# EAGLE schematic mainboard (EAGLE 7.4.0)

## Sheet 1 of 5
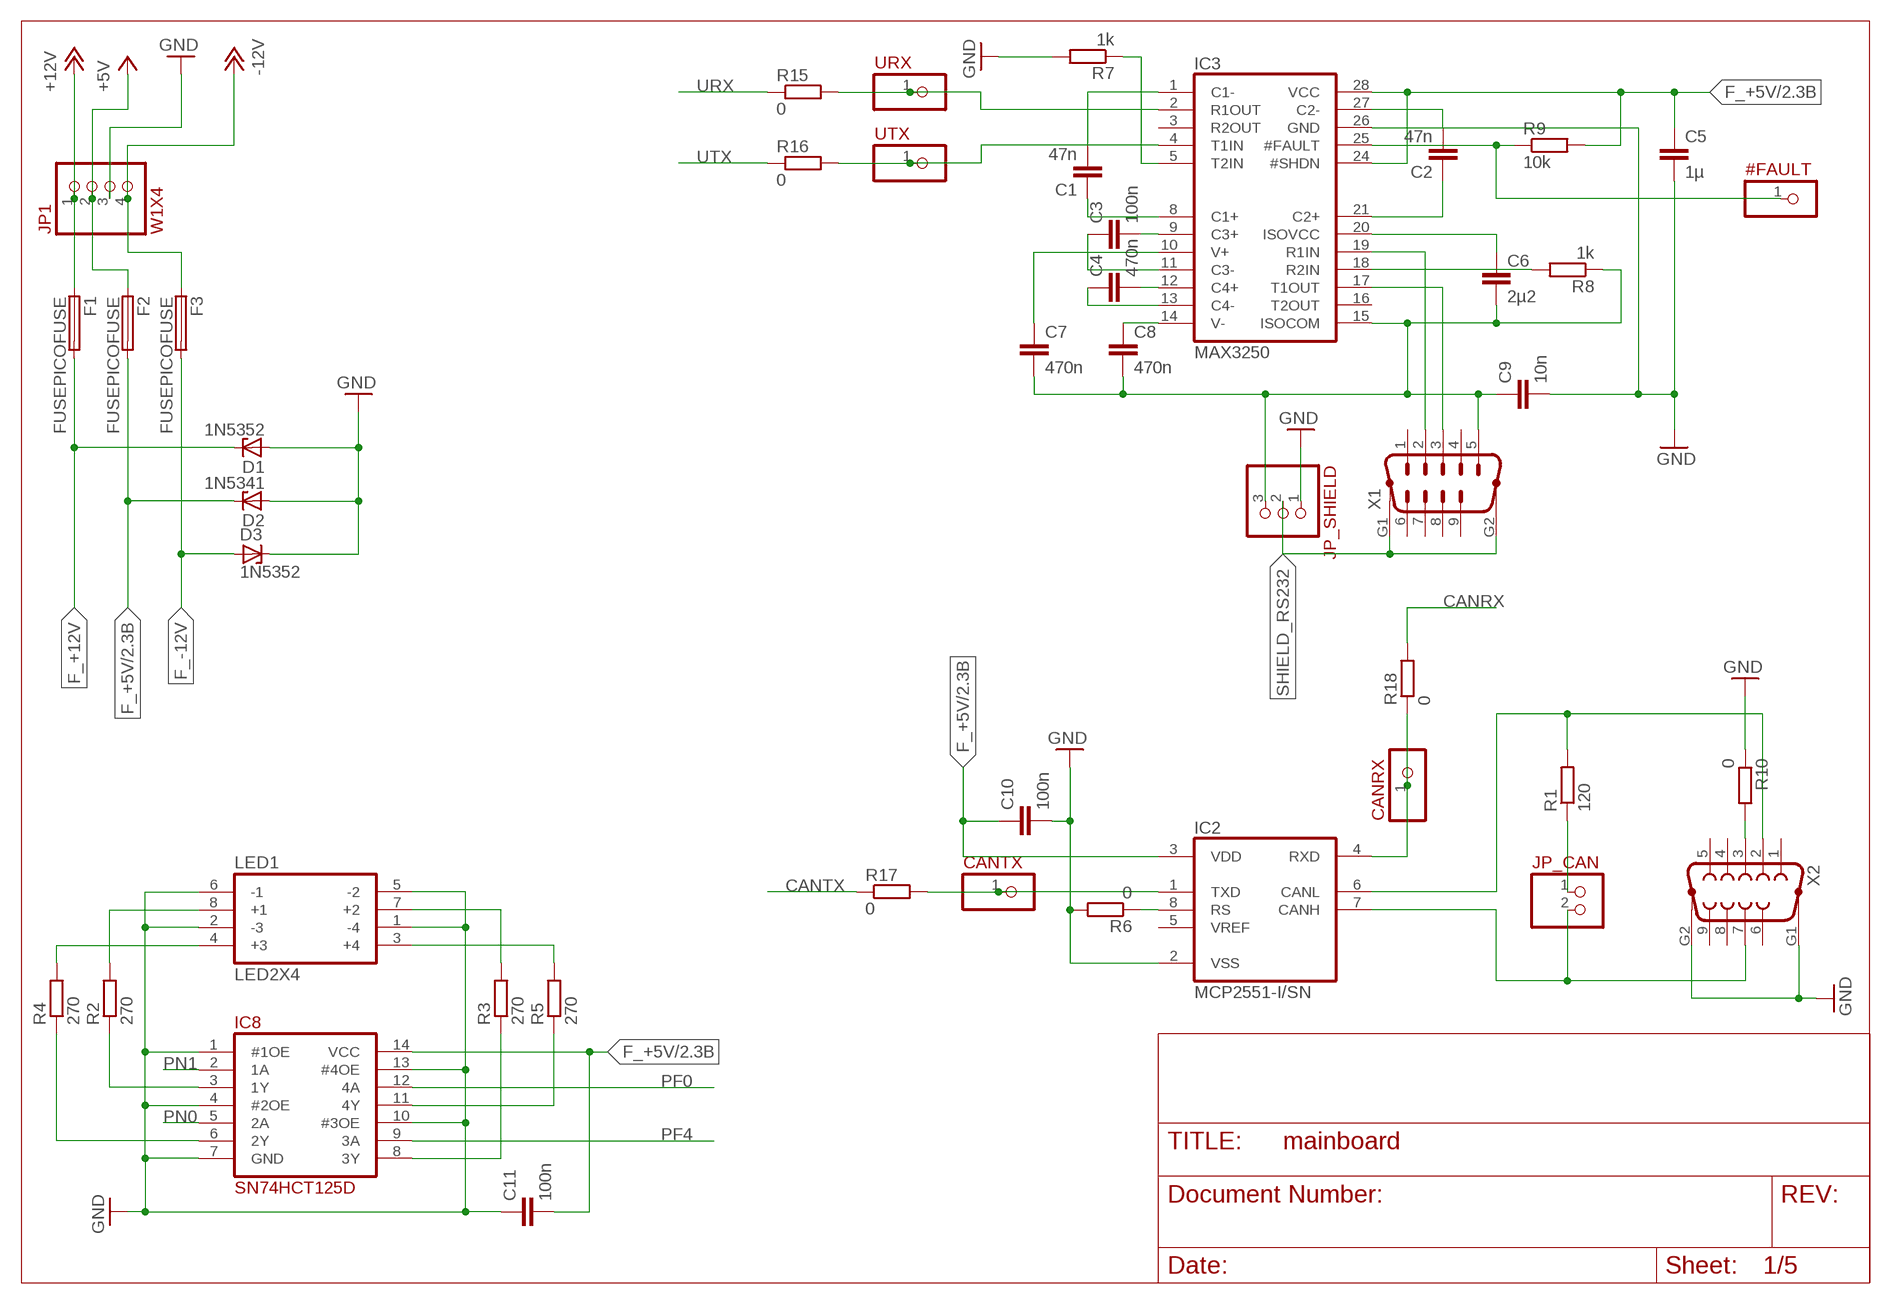
[diagram p0: schematic, sheet 1]

### Parts
#FAULT  PINH-1X1  [1X1]
C1  47n  C2220  [C2220]
C2  47n  C2220  [C2220]
C3  100n  C-EUC0805  [C0805]
C4  470n  C-EUC0805  [C0805]
C5  1µ  C-EUC0805  [C0805]
C6  2µ2  C-EUC0805  [C0805]
C7  470n  C-EUC0805  [C0805]
C8  470n  C-EUC0805  [C0805]
C9  10n  C1812  [C1812]
C10  100n  C-EUC0805  [C0805]
C11  100n  C-EUC0805  [C0805]
CANRX  PINH-1X1  [1X1]
CANTX  PINH-1X1  [1X1]
D1  1N5352  1N5333  [C1702-15]
D2  1N5341  1N5333  [C1702-15]
D3  1N5352  1N5333  [C1702-15]
F1  FUSEPICOFUSE  [PICOFUSE]
F2  FUSEPICOFUSE  [PICOFUSE]
F3  FUSEPICOFUSE  [PICOFUSE]
IC2  MCP2551-I/SN  [SO08]
IC3  MAX3250  [SSOP28_A28M-3]
IC8  SN74HCT125D  [SOIC14_D]
JP1  W1X4  [W1X4]
JP_CAN  PINH-1X2  [1X2]
JP_SHIELD  PINH-1X3  [1X3]
LED1  LED2X4  [LED2X4]
R1  120  R-EU_R0805  [R0805]
R2  270  R-EU_R0805  [R0805]
R3  270  R-EU_R0805  [R0805]
R4  270  R-EU_R0805  [R0805]
R5  270  R-EU_R0805  [R0805]
R6  0  R-EU_R0805  [R0805]
R7  1k  R-EU_R0805  [R0805]
R8  1k  R-EU_R0805  [R0805]
R9  10k  R-EU_R0805  [R0805]
R10  0  R-EU_R0805  [R0805]
R15  0  R-EU_R0805  [R0805]
R16  0  R-EU_R0805  [R0805]
R17  0  R-EU_R0805  [R0805]
R18  0  R-EU_R0805  [R0805]
URX  PINH-1X1  [1X1]
UTX  PINH-1X1  [1X1]
X1  M09HP  [M09HP]
X2  F09HP  [F09HP]

### Nets
+5V: F2.1 JP1.2
+12V: F1.1 JP1.1
-12V: F3.1 JP1.4
CANRX: R18.2 ; also sheet 2
CANTX: R17.1 ; also sheet 2
F_+5V: C5.1 C10.1 C11.2 D2.C F2.2 IC2.3(VDD) IC3.24(#SHDN) IC3.28(VCC) IC8.14(VCC) R9.2 ; also sheet 2,3,4,5
F_+12V: D1.C F1.2 ; also sheet 3,4,5
F_-12V: D3.A F3.2 ; also sheet 3,4,5
GND: C5.2 C9.2 C10.2 C11.1 D1.A D2.A D3.C IC2.2(VSS) IC3.26(GND) IC8.1(#1OE) IC8.4(#2OE) IC8.7(GND) IC8.10(#3OE) IC8.13(#4OE) JP1.3 JP_SHIELD.1 LED1.1(-4) LED1.2(-3) LED1.5(-2) LED1.6(-1) R6.2 R7.2 R10.1 X2.G1 X2.G2 ; also sheet 2,3,4,5
ISOCOM: C6.2 C7.2 C8.2 C9.1 IC3.15(ISOCOM) JP_SHIELD.3 R8.1 X1.5
N$1: JP_CAN.1 R1.1
N$2: IC3.17(T1OUT) X1.3
N$3: C4.2 IC3.12(C4+)
N$4: C4.1 IC3.13(C4-)
N$5: IC3.19(R1IN) X1.2
N$6: C3.2 IC3.9(C3+)
N$7: C3.1 IC3.11(C3-)
N$8: C2.1 IC3.21(C2+)
N$9: C2.2 IC3.27(C2-)
N$10: C1.2 IC3.1(C1-)
N$11: C1.1 IC3.8(C1+)
N$12: C6.1 IC3.20(ISOVCC)
N$13: IC3.2(R1OUT) R15.2 URX.1
N$14: IC3.4(T1IN) R16.2 UTX.1
N$15: CANTX.1 IC2.1(TXD) R17.2
N$16: CANRX.1 IC2.4(RXD) R18.1
N$17: IC2.8(RS) R6.1
N$18: LED1.7(+2) R3.2
N$19: IC8.3(1Y) R2.1
N$20: IC8.6(2Y) R4.1
N$21: IC8.8(3Y) R3.1
N$22: IC8.11(4Y) R5.1
N$23: LED1.3(+4) R5.2
N$24: LED1.8(+1) R2.2
N$25: LED1.4(+3) R4.2
N$26: IC3.18(R2IN) R8.2
N$27: IC3.5(T2IN) R7.1
N$28: #FAULT.1 IC3.25(#FAULT) R9.1
N$30: R10.2 X2.3
N$96: IC2.7(CANH) JP_CAN.2 X2.7
N$97: IC2.6(CANL) R1.2 X2.2
PF0: IC8.12(4A) ; also sheet 3,4,5
PF4: IC8.9(3A) ; also sheet 3,4,5
PN0: IC8.5(2A) ; also sheet 3,4,5
PN1: IC8.2(1A) ; also sheet 3,4,5
SHIELD_RS232: JP_SHIELD.2 X1.G1 X1.G2
URX: R15.1 ; also sheet 2
UTX: R16.1 ; also sheet 2
V+: C7.1 IC3.10(V+)
V-: C8.1 IC3.14(V-)
Unconnected: IC2.5(VREF) IC3.3(R2OUT) IC3.16(T2OUT) X1.1 X1.4 X1.6 X1.7 X1.8 X1.9 X2.1 X2.4 X2.5 X2.6 X2.8 X2.9

## Sheet 2 of 5
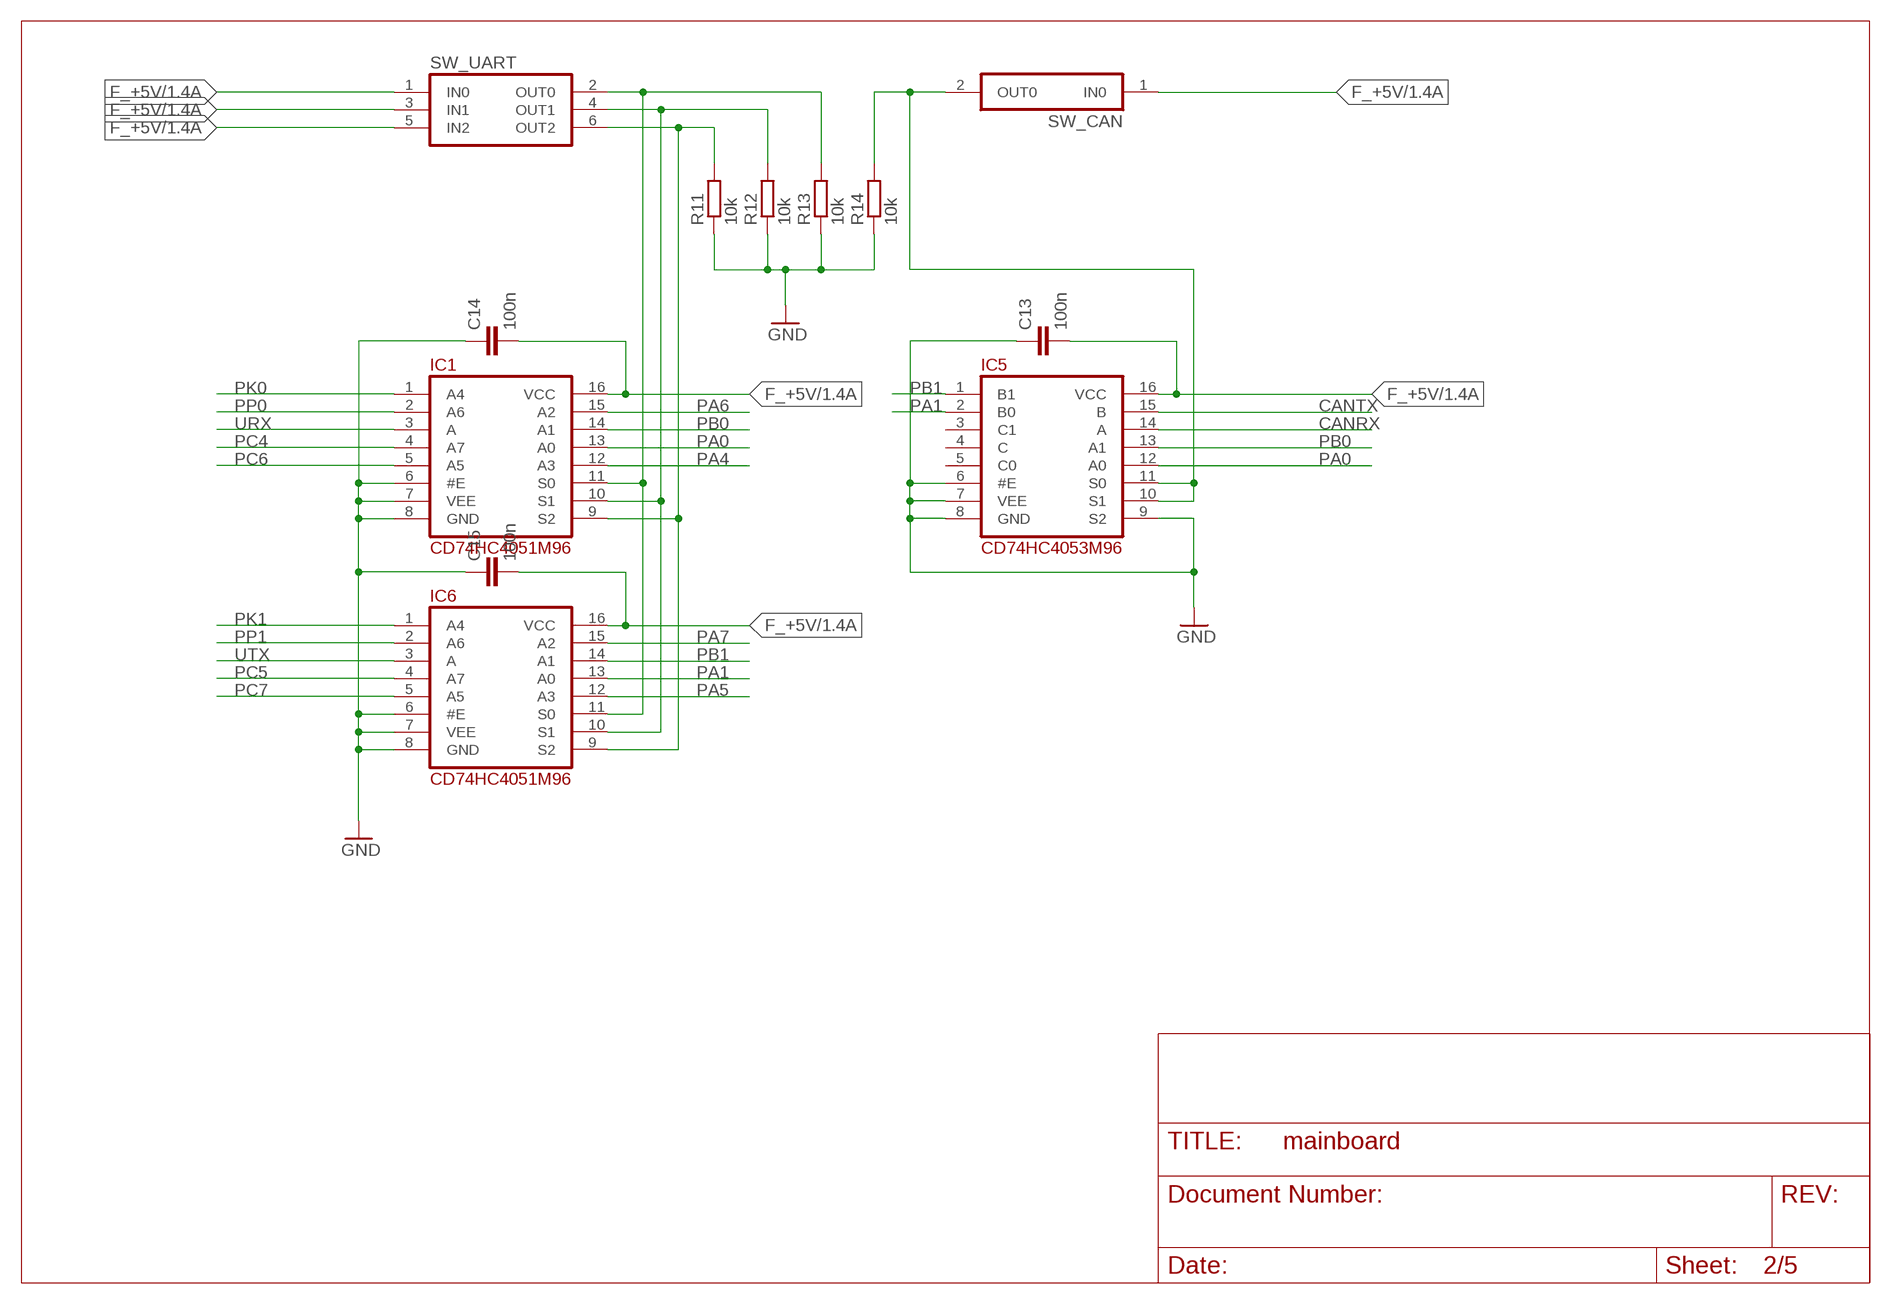
[diagram p1: schematic, sheet 2]

### Parts
C13  100n  C-EUC0805  [C0805]
C14  100n  C-EUC0805  [C0805]
C15  100n  C-EUC0805  [C0805]
IC1  CD74HC4051M96  [SOIC16_D]
IC5  CD74HC4053M96  [SOIC16_D]
IC6  CD74HC4051M96  [SOIC16_D]
R11  10k  R-EU_R0805  [R0805]
R12  10k  R-EU_R0805  [R0805]
R13  10k  R-EU_R0805  [R0805]
R14  10k  R-EU_R0805  [R0805]
SW_CAN  NT01  [NT01]
SW_UART  NT03  [NT03]

### Nets
CANRX: IC5.14(A) ; also sheet 1
CANTX: IC5.15(B) ; also sheet 1
F_+5V: C13.2 C14.2 C15.2 IC1.16(VCC) IC5.16(VCC) IC6.16(VCC) SW_CAN.1(IN0) SW_UART.1(IN0) SW_UART.3(IN1) SW_UART.5(IN2) ; also sheet 1,3,4,5
GND: C13.1 C14.1 C15.1 IC1.6(#E) IC1.7(VEE) IC1.8(GND) IC5.6(#E) IC5.7(VEE) IC5.8(GND) IC5.9(S2) IC6.6(#E) IC6.7(VEE) IC6.8(GND) R11.1 R12.1 R13.1 R14.1 ; also sheet 1,3,4,5
N$32: IC1.9(S2) IC6.9(S2) R11.2 SW_UART.6(OUT2)
N$33: IC1.10(S1) IC6.10(S1) R12.2 SW_UART.4(OUT1)
N$34: IC1.11(S0) IC6.11(S0) R13.2 SW_UART.2(OUT0)
N$35: IC5.10(S1) IC5.11(S0) R14.2 SW_CAN.2(OUT0)
PA0: IC1.13(A0) IC5.12(A0) ; also sheet 3,4,5
PA1: IC5.2(B0) IC6.13(A0) ; also sheet 3,4,5
PA4: IC1.12(A3) ; also sheet 3,4,5
PA5: IC6.12(A3) ; also sheet 3,4,5
PA6: IC1.15(A2) ; also sheet 3,4,5
PA7: IC6.15(A2) ; also sheet 3,4,5
PB0: IC1.14(A1) IC5.13(A1) ; also sheet 3,4,5
PB1: IC5.1(B1) IC6.14(A1) ; also sheet 3,4,5
PC4: IC1.4(A7) ; also sheet 3,4,5
PC5: IC6.4(A7) ; also sheet 3,4,5
PC6: IC1.5(A5) ; also sheet 3,4,5
PC7: IC6.5(A5) ; also sheet 3,4,5
PK0: IC1.1(A4) ; also sheet 3,4,5
PK1: IC6.1(A4) ; also sheet 3,4,5
PP0: IC1.2(A6) ; also sheet 3,4,5
PP1: IC6.2(A6) ; also sheet 3,4,5
URX: IC1.3(A) ; also sheet 1
UTX: IC6.3(A) ; also sheet 1
Unconnected: IC5.3(C1) IC5.4(C) IC5.5(C0)

## Sheet 3 of 5
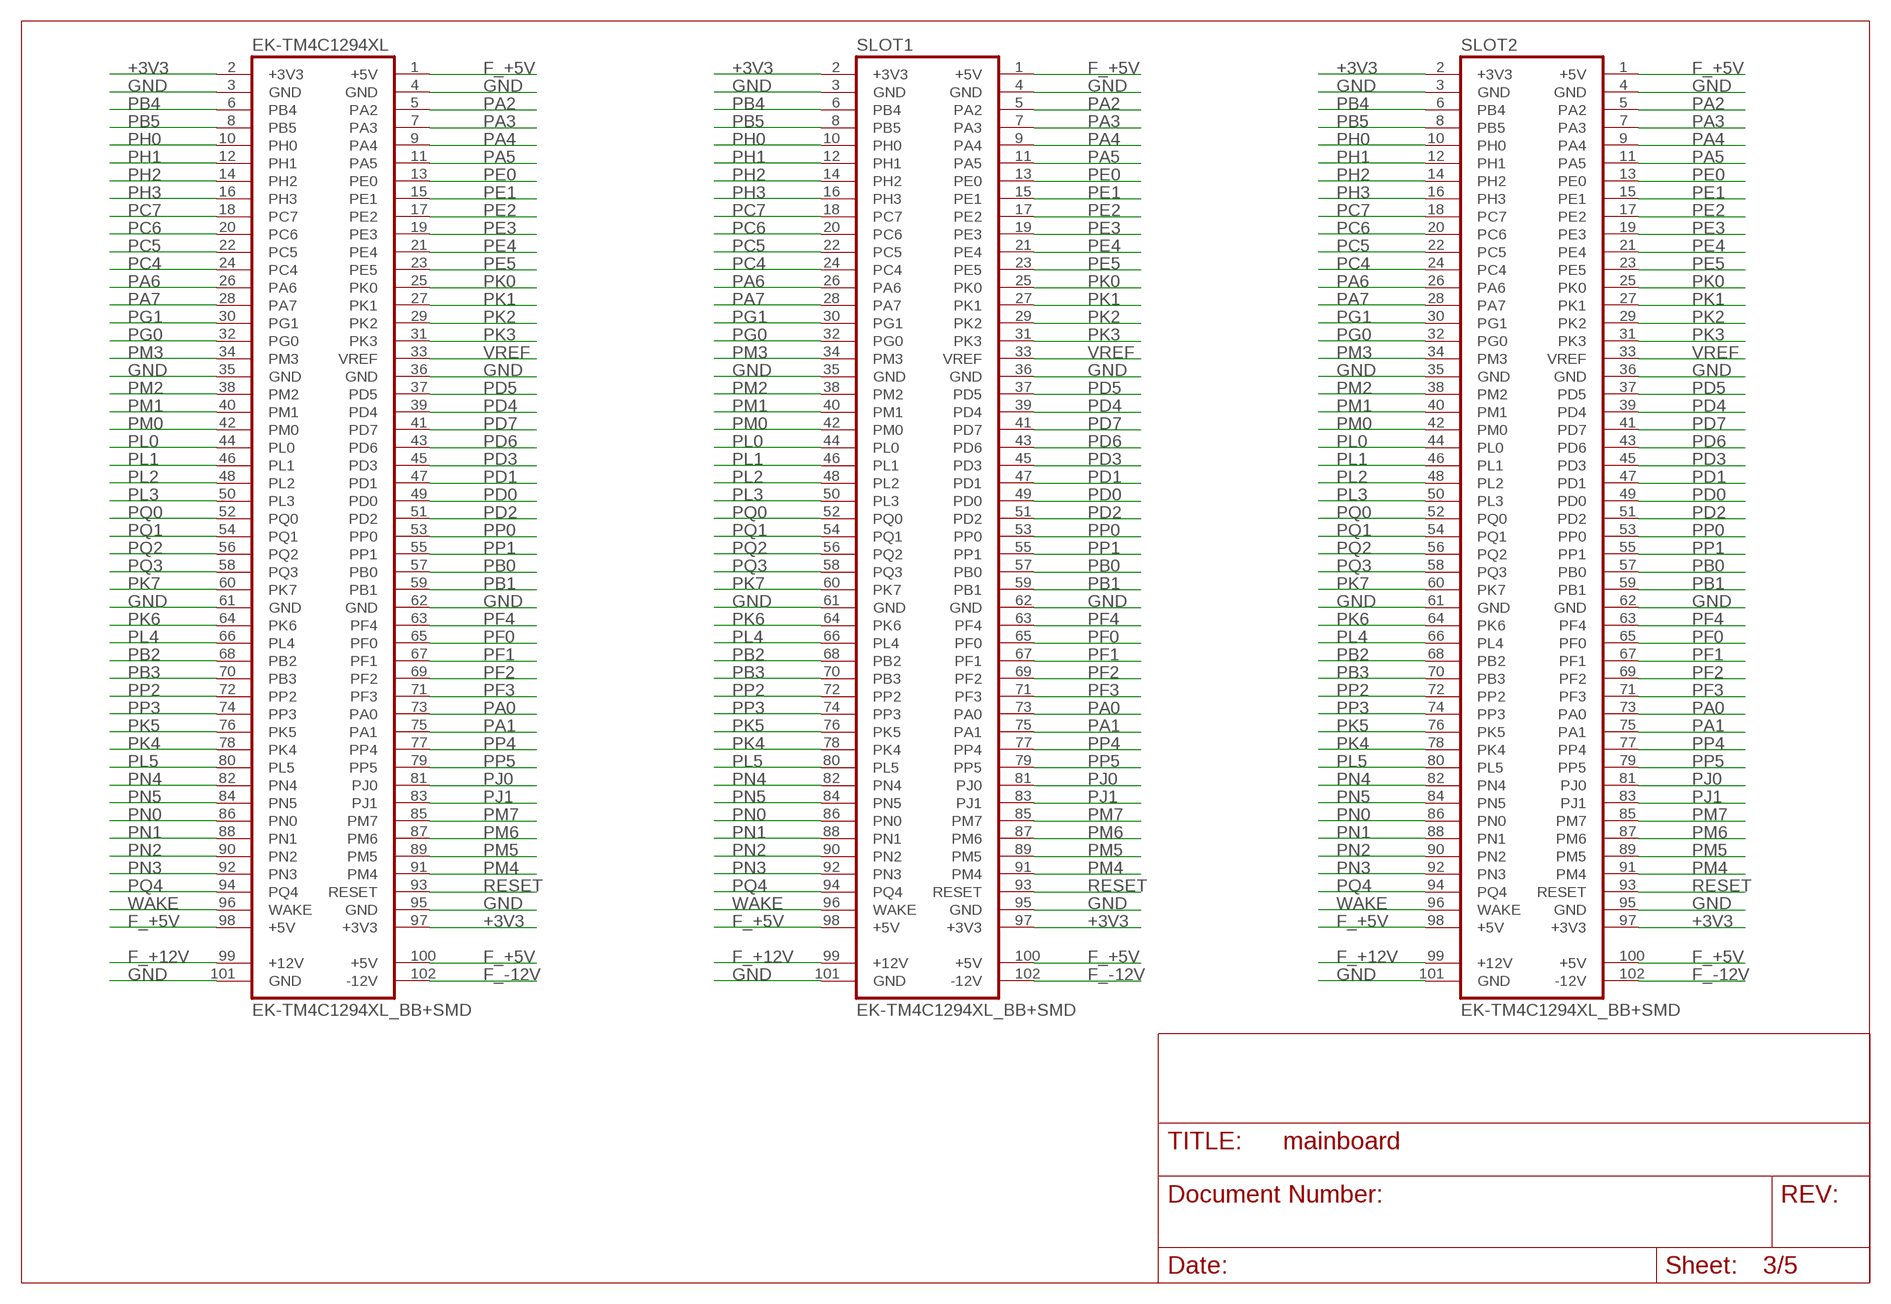
[diagram p2: schematic, sheet 3]

### Parts
EK-TM4C1294XL  EK-TM4C1294XL_BB+SMD  [EK-TM4C1294XL_BB+SMD]
SLOT1  EK-TM4C1294XL_BB+SMD  [EK-TM4C1294XL_BB+SMD]
SLOT2  EK-TM4C1294XL_BB+SMD  [EK-TM4C1294XL_BB+SMD]

### Nets
+3V3: EK-TM4C1294XL.2(+3V3) EK-TM4C1294XL.97(+3V3) SLOT1.2(+3V3) SLOT1.97(+3V3) SLOT2.2(+3V3) SLOT2.97(+3V3) ; also sheet 4,5
F_+5V: EK-TM4C1294XL.1(+5V) EK-TM4C1294XL.98(+5V) EK-TM4C1294XL.100(+5V) SLOT1.1(+5V) SLOT1.98(+5V) SLOT1.100(+5V) SLOT2.1(+5V) SLOT2.98(+5V) SLOT2.100(+5V) ; also sheet 1,2,4,5
F_+12V: EK-TM4C1294XL.99(+12V) SLOT1.99(+12V) SLOT2.99(+12V) ; also sheet 1,4,5
F_-12V: EK-TM4C1294XL.102(-12V) SLOT1.102(-12V) SLOT2.102(-12V) ; also sheet 1,4,5
GND: EK-TM4C1294XL.3(GND) EK-TM4C1294XL.4(GND) EK-TM4C1294XL.35(GND) EK-TM4C1294XL.36(GND) EK-TM4C1294XL.61(GND) EK-TM4C1294XL.62(GND) EK-TM4C1294XL.95(GND) EK-TM4C1294XL.101(GND) SLOT1.3(GND) SLOT1.4(GND) SLOT1.35(GND) SLOT1.36(GND) SLOT1.61(GND) SLOT1.62(GND) SLOT1.95(GND) SLOT1.101(GND) SLOT2.3(GND) SLOT2.4(GND) SLOT2.35(GND) SLOT2.36(GND) SLOT2.61(GND) SLOT2.62(GND) SLOT2.95(GND) SLOT2.101(GND) ; also sheet 1,2,4,5
PA0: EK-TM4C1294XL.73(PA0) SLOT1.73(PA0) SLOT2.73(PA0) ; also sheet 2,4,5
PA1: EK-TM4C1294XL.75(PA1) SLOT1.75(PA1) SLOT2.75(PA1) ; also sheet 2,4,5
PA2: EK-TM4C1294XL.5(PA2) SLOT1.5(PA2) SLOT2.5(PA2) ; also sheet 4,5
PA3: EK-TM4C1294XL.7(PA3) SLOT1.7(PA3) SLOT2.7(PA3) ; also sheet 4,5
PA4: EK-TM4C1294XL.9(PA4) SLOT1.9(PA4) SLOT2.9(PA4) ; also sheet 2,4,5
PA5: EK-TM4C1294XL.11(PA5) SLOT1.11(PA5) SLOT2.11(PA5) ; also sheet 2,4,5
PA6: EK-TM4C1294XL.26(PA6) SLOT1.26(PA6) SLOT2.26(PA6) ; also sheet 2,4,5
PA7: EK-TM4C1294XL.28(PA7) SLOT1.28(PA7) SLOT2.28(PA7) ; also sheet 2,4,5
PB0: EK-TM4C1294XL.57(PB0) SLOT1.57(PB0) SLOT2.57(PB0) ; also sheet 2,4,5
PB1: EK-TM4C1294XL.59(PB1) SLOT1.59(PB1) SLOT2.59(PB1) ; also sheet 2,4,5
PB2: EK-TM4C1294XL.68(PB2) SLOT1.68(PB2) SLOT2.68(PB2) ; also sheet 4,5
PB3: EK-TM4C1294XL.70(PB3) SLOT1.70(PB3) SLOT2.70(PB3) ; also sheet 4,5
PB4: EK-TM4C1294XL.6(PB4) SLOT1.6(PB4) SLOT2.6(PB4) ; also sheet 4,5
PB5: EK-TM4C1294XL.8(PB5) SLOT1.8(PB5) SLOT2.8(PB5) ; also sheet 4,5
PC4: EK-TM4C1294XL.24(PC4) SLOT1.24(PC4) SLOT2.24(PC4) ; also sheet 2,4,5
PC5: EK-TM4C1294XL.22(PC5) SLOT1.22(PC5) SLOT2.22(PC5) ; also sheet 2,4,5
PC6: EK-TM4C1294XL.20(PC6) SLOT1.20(PC6) SLOT2.20(PC6) ; also sheet 2,4,5
PC7: EK-TM4C1294XL.18(PC7) SLOT1.18(PC7) SLOT2.18(PC7) ; also sheet 2,4,5
PD0: EK-TM4C1294XL.49(PD0) SLOT1.49(PD0) SLOT2.49(PD0) ; also sheet 4,5
PD1: EK-TM4C1294XL.47(PD1) SLOT1.47(PD1) SLOT2.47(PD1) ; also sheet 4,5
PD2: EK-TM4C1294XL.51(PD2) SLOT1.51(PD2) SLOT2.51(PD2) ; also sheet 4,5
PD3: EK-TM4C1294XL.45(PD3) SLOT1.45(PD3) SLOT2.45(PD3) ; also sheet 4,5
PD4: EK-TM4C1294XL.39(PD4) SLOT1.39(PD4) SLOT2.39(PD4) ; also sheet 4,5
PD5: EK-TM4C1294XL.37(PD5) SLOT1.37(PD5) SLOT2.37(PD5) ; also sheet 4,5
PD6: EK-TM4C1294XL.43(PD6) SLOT1.43(PD6) SLOT2.43(PD6) ; also sheet 4,5
PD7: EK-TM4C1294XL.41(PD7) SLOT1.41(PD7) SLOT2.41(PD7) ; also sheet 4,5
PE0: EK-TM4C1294XL.13(PE0) SLOT1.13(PE0) SLOT2.13(PE0) ; also sheet 4,5
PE1: EK-TM4C1294XL.15(PE1) SLOT1.15(PE1) SLOT2.15(PE1) ; also sheet 4,5
PE2: EK-TM4C1294XL.17(PE2) SLOT1.17(PE2) SLOT2.17(PE2) ; also sheet 4,5
PE3: EK-TM4C1294XL.19(PE3) SLOT1.19(PE3) SLOT2.19(PE3) ; also sheet 4,5
PE4: EK-TM4C1294XL.21(PE4) SLOT1.21(PE4) SLOT2.21(PE4) ; also sheet 4,5
PE5: EK-TM4C1294XL.23(PE5) SLOT1.23(PE5) SLOT2.23(PE5) ; also sheet 4,5
PF0: EK-TM4C1294XL.65(PF0) SLOT1.65(PF0) SLOT2.65(PF0) ; also sheet 1,4,5
PF1: EK-TM4C1294XL.67(PF1) SLOT1.67(PF1) SLOT2.67(PF1) ; also sheet 4,5
PF2: EK-TM4C1294XL.69(PF2) SLOT1.69(PF2) SLOT2.69(PF2) ; also sheet 4,5
PF3: EK-TM4C1294XL.71(PF3) SLOT1.71(PF3) SLOT2.71(PF3) ; also sheet 4,5
PF4: EK-TM4C1294XL.63(PF4) SLOT1.63(PF4) SLOT2.63(PF4) ; also sheet 1,4,5
PG0: EK-TM4C1294XL.32(PG0) SLOT1.32(PG0) SLOT2.32(PG0) ; also sheet 4,5
PG1: EK-TM4C1294XL.30(PG1) SLOT1.30(PG1) SLOT2.30(PG1) ; also sheet 4,5
PH0: EK-TM4C1294XL.10(PH0) SLOT1.10(PH0) SLOT2.10(PH0) ; also sheet 4,5
PH1: EK-TM4C1294XL.12(PH1) SLOT1.12(PH1) SLOT2.12(PH1) ; also sheet 4,5
PH2: EK-TM4C1294XL.14(PH2) SLOT1.14(PH2) SLOT2.14(PH2) ; also sheet 4,5
PH3: EK-TM4C1294XL.16(PH3) SLOT1.16(PH3) SLOT2.16(PH3) ; also sheet 4,5
PJ0: EK-TM4C1294XL.81(PJ0) SLOT1.81(PJ0) SLOT2.81(PJ0) ; also sheet 4,5
PJ1: EK-TM4C1294XL.83(PJ1) SLOT1.83(PJ1) SLOT2.83(PJ1) ; also sheet 4,5
PK0: EK-TM4C1294XL.25(PK0) SLOT1.25(PK0) SLOT2.25(PK0) ; also sheet 2,4,5
PK1: EK-TM4C1294XL.27(PK1) SLOT1.27(PK1) SLOT2.27(PK1) ; also sheet 2,4,5
PK2: EK-TM4C1294XL.29(PK2) SLOT1.29(PK2) SLOT2.29(PK2) ; also sheet 4,5
PK3: EK-TM4C1294XL.31(PK3) SLOT1.31(PK3) SLOT2.31(PK3) ; also sheet 4,5
PK4: EK-TM4C1294XL.78(PK4) SLOT1.78(PK4) SLOT2.78(PK4) ; also sheet 4,5
PK5: EK-TM4C1294XL.76(PK5) SLOT1.76(PK5) SLOT2.76(PK5) ; also sheet 4,5
PK6: EK-TM4C1294XL.64(PK6) SLOT1.64(PK6) SLOT2.64(PK6) ; also sheet 4,5
PK7: EK-TM4C1294XL.60(PK7) SLOT1.60(PK7) SLOT2.60(PK7) ; also sheet 4,5
PL0: EK-TM4C1294XL.44(PL0) SLOT1.44(PL0) SLOT2.44(PL0) ; also sheet 4,5
PL1: EK-TM4C1294XL.46(PL1) SLOT1.46(PL1) SLOT2.46(PL1) ; also sheet 4,5
PL2: EK-TM4C1294XL.48(PL2) SLOT1.48(PL2) SLOT2.48(PL2) ; also sheet 4,5
PL3: EK-TM4C1294XL.50(PL3) SLOT1.50(PL3) SLOT2.50(PL3) ; also sheet 4,5
PL4: EK-TM4C1294XL.66(PL4) SLOT1.66(PL4) SLOT2.66(PL4) ; also sheet 4,5
PL5: EK-TM4C1294XL.80(PL5) SLOT1.80(PL5) SLOT2.80(PL5) ; also sheet 4,5
PM0: EK-TM4C1294XL.42(PM0) SLOT1.42(PM0) SLOT2.42(PM0) ; also sheet 4,5
PM1: EK-TM4C1294XL.40(PM1) SLOT1.40(PM1) SLOT2.40(PM1) ; also sheet 4,5
PM2: EK-TM4C1294XL.38(PM2) SLOT1.38(PM2) SLOT2.38(PM2) ; also sheet 4,5
PM3: EK-TM4C1294XL.34(PM3) SLOT1.34(PM3) SLOT2.34(PM3) ; also sheet 4,5
PM4: EK-TM4C1294XL.91(PM4) SLOT1.91(PM4) SLOT2.91(PM4) ; also sheet 4,5
PM5: EK-TM4C1294XL.89(PM5) SLOT1.89(PM5) SLOT2.89(PM5) ; also sheet 4,5
PM6: EK-TM4C1294XL.87(PM6) SLOT1.87(PM6) SLOT2.87(PM6) ; also sheet 4,5
PM7: EK-TM4C1294XL.85(PM7) SLOT1.85(PM7) SLOT2.85(PM7) ; also sheet 4,5
PN0: EK-TM4C1294XL.86(PN0) SLOT1.86(PN0) SLOT2.86(PN0) ; also sheet 1,4,5
PN1: EK-TM4C1294XL.88(PN1) SLOT1.88(PN1) SLOT2.88(PN1) ; also sheet 1,4,5
PN2: EK-TM4C1294XL.90(PN2) SLOT1.90(PN2) SLOT2.90(PN2) ; also sheet 4,5
PN3: EK-TM4C1294XL.92(PN3) SLOT1.92(PN3) SLOT2.92(PN3) ; also sheet 4,5
PN4: EK-TM4C1294XL.82(PN4) SLOT1.82(PN4) SLOT2.82(PN4) ; also sheet 4,5
PN5: EK-TM4C1294XL.84(PN5) SLOT1.84(PN5) SLOT2.84(PN5) ; also sheet 4,5
PP0: EK-TM4C1294XL.53(PP0) SLOT1.53(PP0) SLOT2.53(PP0) ; also sheet 2,4,5
PP1: EK-TM4C1294XL.55(PP1) SLOT1.55(PP1) SLOT2.55(PP1) ; also sheet 2,4,5
PP2: EK-TM4C1294XL.72(PP2) SLOT1.72(PP2) SLOT2.72(PP2) ; also sheet 4,5
PP3: EK-TM4C1294XL.74(PP3) SLOT1.74(PP3) SLOT2.74(PP3) ; also sheet 4,5
PP4: EK-TM4C1294XL.77(PP4) SLOT1.77(PP4) SLOT2.77(PP4) ; also sheet 4,5
PP5: EK-TM4C1294XL.79(PP5) SLOT1.79(PP5) SLOT2.79(PP5) ; also sheet 4,5
PQ0: EK-TM4C1294XL.52(PQ0) SLOT1.52(PQ0) SLOT2.52(PQ0) ; also sheet 4,5
PQ1: EK-TM4C1294XL.54(PQ1) SLOT1.54(PQ1) SLOT2.54(PQ1) ; also sheet 4,5
PQ2: EK-TM4C1294XL.56(PQ2) SLOT1.56(PQ2) SLOT2.56(PQ2) ; also sheet 4,5
PQ3: EK-TM4C1294XL.58(PQ3) SLOT1.58(PQ3) SLOT2.58(PQ3) ; also sheet 4,5
PQ4: EK-TM4C1294XL.94(PQ4) SLOT1.94(PQ4) SLOT2.94(PQ4) ; also sheet 4,5
RESET: EK-TM4C1294XL.93(RESET) SLOT1.93(RESET) SLOT2.93(RESET) ; also sheet 4,5
VREF: EK-TM4C1294XL.33(VREF) SLOT1.33(VREF) SLOT2.33(VREF) ; also sheet 4,5
WAKE: EK-TM4C1294XL.96(WAKE) SLOT1.96(WAKE) SLOT2.96(WAKE) ; also sheet 4,5

## Sheet 4 of 5
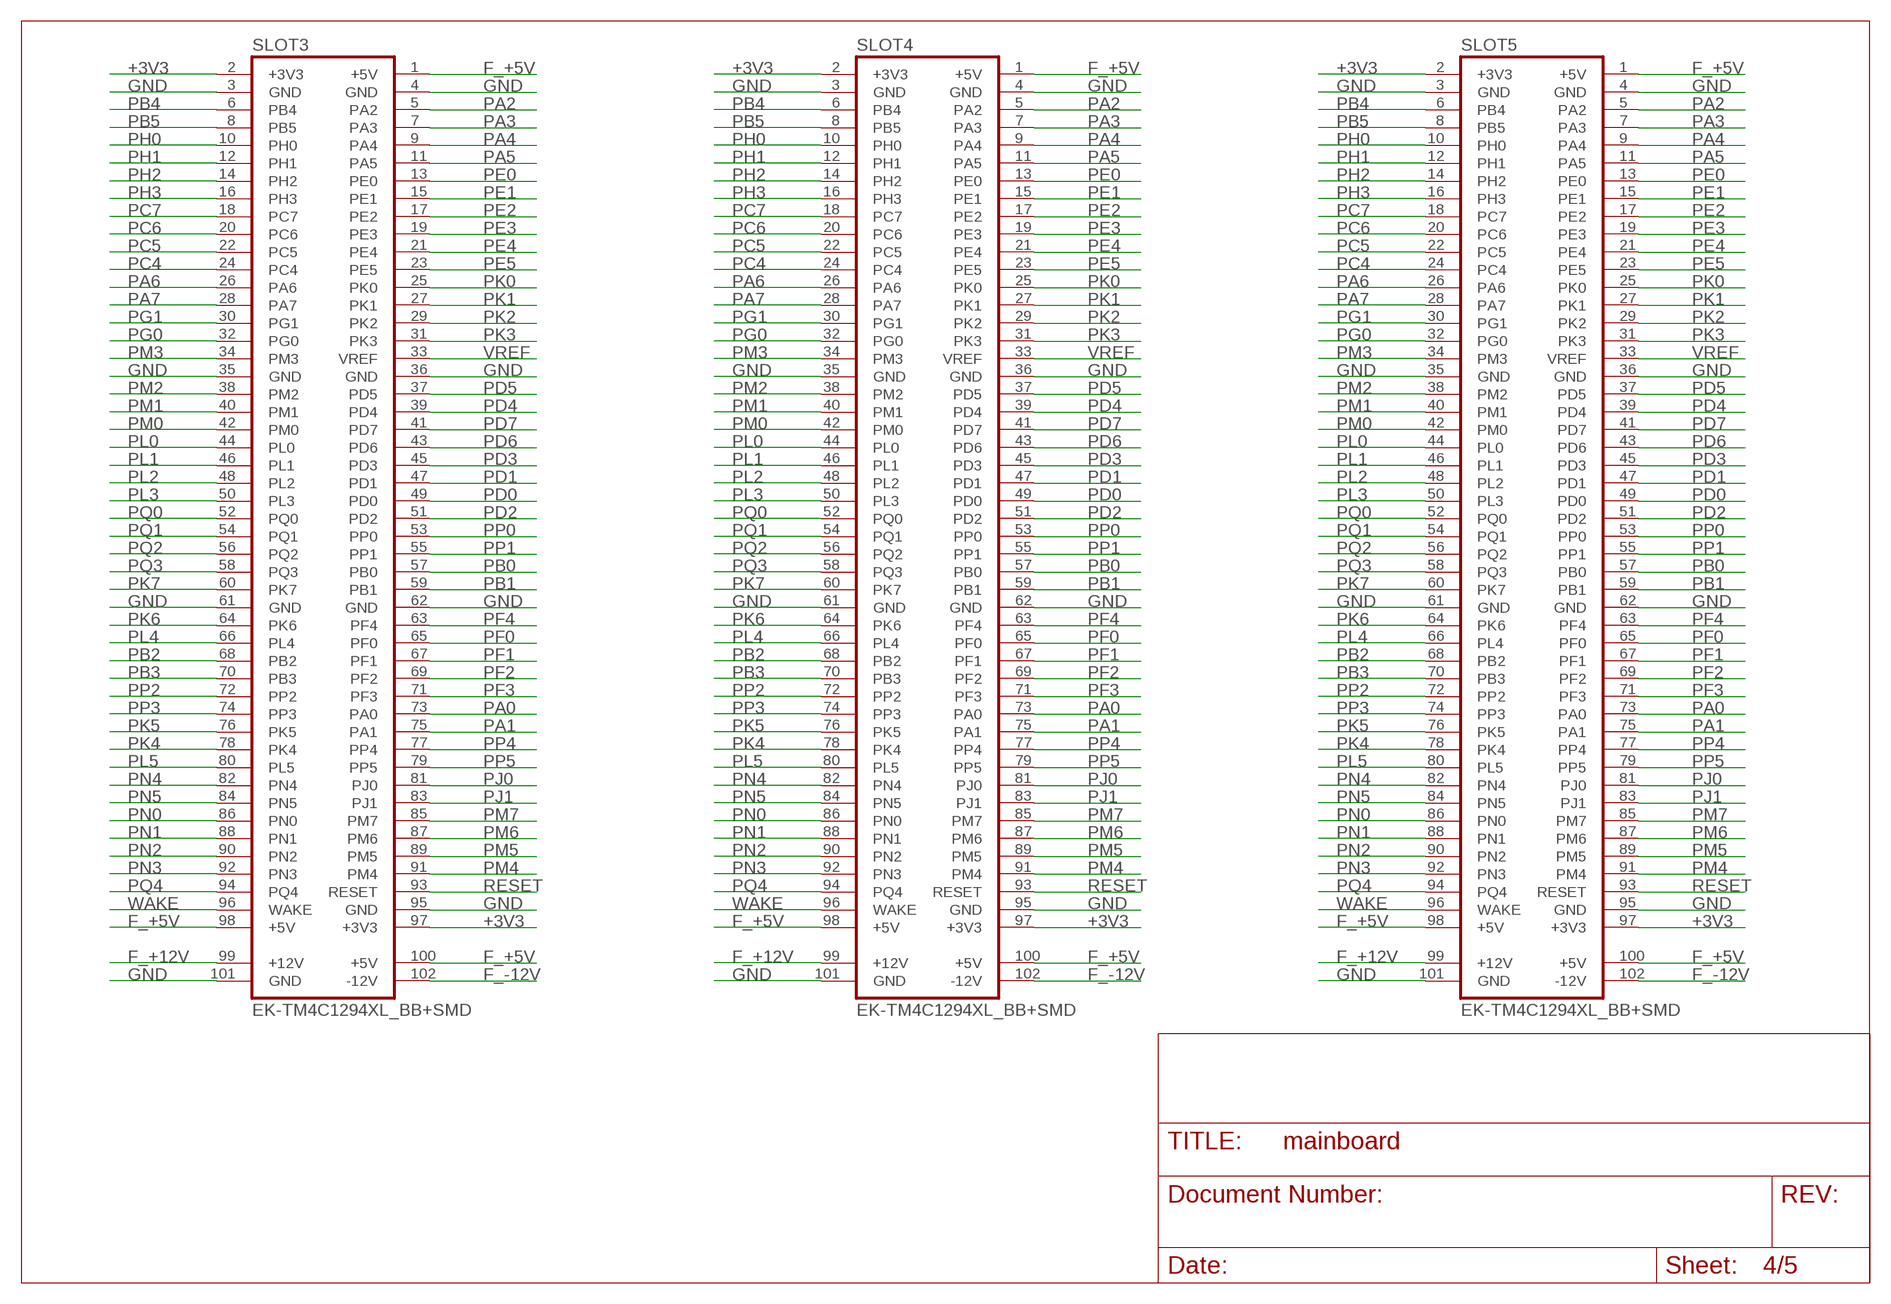
[diagram p3: schematic, sheet 4]

### Parts
SLOT3  EK-TM4C1294XL_BB+SMD  [EK-TM4C1294XL_BB+SMD]
SLOT4  EK-TM4C1294XL_BB+SMD  [EK-TM4C1294XL_BB+SMD]
SLOT5  EK-TM4C1294XL_BB+SMD  [EK-TM4C1294XL_BB+SMD]

### Nets
+3V3: SLOT3.2(+3V3) SLOT3.97(+3V3) SLOT4.2(+3V3) SLOT4.97(+3V3) SLOT5.2(+3V3) SLOT5.97(+3V3) ; also sheet 3,5
F_+5V: SLOT3.1(+5V) SLOT3.98(+5V) SLOT3.100(+5V) SLOT4.1(+5V) SLOT4.98(+5V) SLOT4.100(+5V) SLOT5.1(+5V) SLOT5.98(+5V) SLOT5.100(+5V) ; also sheet 1,2,3,5
F_+12V: SLOT3.99(+12V) SLOT4.99(+12V) SLOT5.99(+12V) ; also sheet 1,3,5
F_-12V: SLOT3.102(-12V) SLOT4.102(-12V) SLOT5.102(-12V) ; also sheet 1,3,5
GND: SLOT3.3(GND) SLOT3.4(GND) SLOT3.35(GND) SLOT3.36(GND) SLOT3.61(GND) SLOT3.62(GND) SLOT3.95(GND) SLOT3.101(GND) SLOT4.3(GND) SLOT4.4(GND) SLOT4.35(GND) SLOT4.36(GND) SLOT4.61(GND) SLOT4.62(GND) SLOT4.95(GND) SLOT4.101(GND) SLOT5.3(GND) SLOT5.4(GND) SLOT5.35(GND) SLOT5.36(GND) SLOT5.61(GND) SLOT5.62(GND) SLOT5.95(GND) SLOT5.101(GND) ; also sheet 1,2,3,5
PA0: SLOT3.73(PA0) SLOT4.73(PA0) SLOT5.73(PA0) ; also sheet 2,3,5
PA1: SLOT3.75(PA1) SLOT4.75(PA1) SLOT5.75(PA1) ; also sheet 2,3,5
PA2: SLOT3.5(PA2) SLOT4.5(PA2) SLOT5.5(PA2) ; also sheet 3,5
PA3: SLOT3.7(PA3) SLOT4.7(PA3) SLOT5.7(PA3) ; also sheet 3,5
PA4: SLOT3.9(PA4) SLOT4.9(PA4) SLOT5.9(PA4) ; also sheet 2,3,5
PA5: SLOT3.11(PA5) SLOT4.11(PA5) SLOT5.11(PA5) ; also sheet 2,3,5
PA6: SLOT3.26(PA6) SLOT4.26(PA6) SLOT5.26(PA6) ; also sheet 2,3,5
PA7: SLOT3.28(PA7) SLOT4.28(PA7) SLOT5.28(PA7) ; also sheet 2,3,5
PB0: SLOT3.57(PB0) SLOT4.57(PB0) SLOT5.57(PB0) ; also sheet 2,3,5
PB1: SLOT3.59(PB1) SLOT4.59(PB1) SLOT5.59(PB1) ; also sheet 2,3,5
PB2: SLOT3.68(PB2) SLOT4.68(PB2) SLOT5.68(PB2) ; also sheet 3,5
PB3: SLOT3.70(PB3) SLOT4.70(PB3) SLOT5.70(PB3) ; also sheet 3,5
PB4: SLOT3.6(PB4) SLOT4.6(PB4) SLOT5.6(PB4) ; also sheet 3,5
PB5: SLOT3.8(PB5) SLOT4.8(PB5) SLOT5.8(PB5) ; also sheet 3,5
PC4: SLOT3.24(PC4) SLOT4.24(PC4) SLOT5.24(PC4) ; also sheet 2,3,5
PC5: SLOT3.22(PC5) SLOT4.22(PC5) SLOT5.22(PC5) ; also sheet 2,3,5
PC6: SLOT3.20(PC6) SLOT4.20(PC6) SLOT5.20(PC6) ; also sheet 2,3,5
PC7: SLOT3.18(PC7) SLOT4.18(PC7) SLOT5.18(PC7) ; also sheet 2,3,5
PD0: SLOT3.49(PD0) SLOT4.49(PD0) SLOT5.49(PD0) ; also sheet 3,5
PD1: SLOT3.47(PD1) SLOT4.47(PD1) SLOT5.47(PD1) ; also sheet 3,5
PD2: SLOT3.51(PD2) SLOT4.51(PD2) SLOT5.51(PD2) ; also sheet 3,5
PD3: SLOT3.45(PD3) SLOT4.45(PD3) SLOT5.45(PD3) ; also sheet 3,5
PD4: SLOT3.39(PD4) SLOT4.39(PD4) SLOT5.39(PD4) ; also sheet 3,5
PD5: SLOT3.37(PD5) SLOT4.37(PD5) SLOT5.37(PD5) ; also sheet 3,5
PD6: SLOT3.43(PD6) SLOT4.43(PD6) SLOT5.43(PD6) ; also sheet 3,5
PD7: SLOT3.41(PD7) SLOT4.41(PD7) SLOT5.41(PD7) ; also sheet 3,5
PE0: SLOT3.13(PE0) SLOT4.13(PE0) SLOT5.13(PE0) ; also sheet 3,5
PE1: SLOT3.15(PE1) SLOT4.15(PE1) SLOT5.15(PE1) ; also sheet 3,5
PE2: SLOT3.17(PE2) SLOT4.17(PE2) SLOT5.17(PE2) ; also sheet 3,5
PE3: SLOT3.19(PE3) SLOT4.19(PE3) SLOT5.19(PE3) ; also sheet 3,5
PE4: SLOT3.21(PE4) SLOT4.21(PE4) SLOT5.21(PE4) ; also sheet 3,5
PE5: SLOT3.23(PE5) SLOT4.23(PE5) SLOT5.23(PE5) ; also sheet 3,5
PF0: SLOT3.65(PF0) SLOT4.65(PF0) SLOT5.65(PF0) ; also sheet 1,3,5
PF1: SLOT3.67(PF1) SLOT4.67(PF1) SLOT5.67(PF1) ; also sheet 3,5
PF2: SLOT3.69(PF2) SLOT4.69(PF2) SLOT5.69(PF2) ; also sheet 3,5
PF3: SLOT3.71(PF3) SLOT4.71(PF3) SLOT5.71(PF3) ; also sheet 3,5
PF4: SLOT3.63(PF4) SLOT4.63(PF4) SLOT5.63(PF4) ; also sheet 1,3,5
PG0: SLOT3.32(PG0) SLOT4.32(PG0) SLOT5.32(PG0) ; also sheet 3,5
PG1: SLOT3.30(PG1) SLOT4.30(PG1) SLOT5.30(PG1) ; also sheet 3,5
PH0: SLOT3.10(PH0) SLOT4.10(PH0) SLOT5.10(PH0) ; also sheet 3,5
PH1: SLOT3.12(PH1) SLOT4.12(PH1) SLOT5.12(PH1) ; also sheet 3,5
PH2: SLOT3.14(PH2) SLOT4.14(PH2) SLOT5.14(PH2) ; also sheet 3,5
PH3: SLOT3.16(PH3) SLOT4.16(PH3) SLOT5.16(PH3) ; also sheet 3,5
PJ0: SLOT3.81(PJ0) SLOT4.81(PJ0) SLOT5.81(PJ0) ; also sheet 3,5
PJ1: SLOT3.83(PJ1) SLOT4.83(PJ1) SLOT5.83(PJ1) ; also sheet 3,5
PK0: SLOT3.25(PK0) SLOT4.25(PK0) SLOT5.25(PK0) ; also sheet 2,3,5
PK1: SLOT3.27(PK1) SLOT4.27(PK1) SLOT5.27(PK1) ; also sheet 2,3,5
PK2: SLOT3.29(PK2) SLOT4.29(PK2) SLOT5.29(PK2) ; also sheet 3,5
PK3: SLOT3.31(PK3) SLOT4.31(PK3) SLOT5.31(PK3) ; also sheet 3,5
PK4: SLOT3.78(PK4) SLOT4.78(PK4) SLOT5.78(PK4) ; also sheet 3,5
PK5: SLOT3.76(PK5) SLOT4.76(PK5) SLOT5.76(PK5) ; also sheet 3,5
PK6: SLOT3.64(PK6) SLOT4.64(PK6) SLOT5.64(PK6) ; also sheet 3,5
PK7: SLOT3.60(PK7) SLOT4.60(PK7) SLOT5.60(PK7) ; also sheet 3,5
PL0: SLOT3.44(PL0) SLOT4.44(PL0) SLOT5.44(PL0) ; also sheet 3,5
PL1: SLOT3.46(PL1) SLOT4.46(PL1) SLOT5.46(PL1) ; also sheet 3,5
PL2: SLOT3.48(PL2) SLOT4.48(PL2) SLOT5.48(PL2) ; also sheet 3,5
PL3: SLOT3.50(PL3) SLOT4.50(PL3) SLOT5.50(PL3) ; also sheet 3,5
PL4: SLOT3.66(PL4) SLOT4.66(PL4) SLOT5.66(PL4) ; also sheet 3,5
PL5: SLOT3.80(PL5) SLOT4.80(PL5) SLOT5.80(PL5) ; also sheet 3,5
PM0: SLOT3.42(PM0) SLOT4.42(PM0) SLOT5.42(PM0) ; also sheet 3,5
PM1: SLOT3.40(PM1) SLOT4.40(PM1) SLOT5.40(PM1) ; also sheet 3,5
PM2: SLOT3.38(PM2) SLOT4.38(PM2) SLOT5.38(PM2) ; also sheet 3,5
PM3: SLOT3.34(PM3) SLOT4.34(PM3) SLOT5.34(PM3) ; also sheet 3,5
PM4: SLOT3.91(PM4) SLOT4.91(PM4) SLOT5.91(PM4) ; also sheet 3,5
PM5: SLOT3.89(PM5) SLOT4.89(PM5) SLOT5.89(PM5) ; also sheet 3,5
PM6: SLOT3.87(PM6) SLOT4.87(PM6) SLOT5.87(PM6) ; also sheet 3,5
PM7: SLOT3.85(PM7) SLOT4.85(PM7) SLOT5.85(PM7) ; also sheet 3,5
PN0: SLOT3.86(PN0) SLOT4.86(PN0) SLOT5.86(PN0) ; also sheet 1,3,5
PN1: SLOT3.88(PN1) SLOT4.88(PN1) SLOT5.88(PN1) ; also sheet 1,3,5
PN2: SLOT3.90(PN2) SLOT4.90(PN2) SLOT5.90(PN2) ; also sheet 3,5
PN3: SLOT3.92(PN3) SLOT4.92(PN3) SLOT5.92(PN3) ; also sheet 3,5
PN4: SLOT3.82(PN4) SLOT4.82(PN4) SLOT5.82(PN4) ; also sheet 3,5
PN5: SLOT3.84(PN5) SLOT4.84(PN5) SLOT5.84(PN5) ; also sheet 3,5
PP0: SLOT3.53(PP0) SLOT4.53(PP0) SLOT5.53(PP0) ; also sheet 2,3,5
PP1: SLOT3.55(PP1) SLOT4.55(PP1) SLOT5.55(PP1) ; also sheet 2,3,5
PP2: SLOT3.72(PP2) SLOT4.72(PP2) SLOT5.72(PP2) ; also sheet 3,5
PP3: SLOT3.74(PP3) SLOT4.74(PP3) SLOT5.74(PP3) ; also sheet 3,5
PP4: SLOT3.77(PP4) SLOT4.77(PP4) SLOT5.77(PP4) ; also sheet 3,5
PP5: SLOT3.79(PP5) SLOT4.79(PP5) SLOT5.79(PP5) ; also sheet 3,5
PQ0: SLOT3.52(PQ0) SLOT4.52(PQ0) SLOT5.52(PQ0) ; also sheet 3,5
PQ1: SLOT3.54(PQ1) SLOT4.54(PQ1) SLOT5.54(PQ1) ; also sheet 3,5
PQ2: SLOT3.56(PQ2) SLOT4.56(PQ2) SLOT5.56(PQ2) ; also sheet 3,5
PQ3: SLOT3.58(PQ3) SLOT4.58(PQ3) SLOT5.58(PQ3) ; also sheet 3,5
PQ4: SLOT3.94(PQ4) SLOT4.94(PQ4) SLOT5.94(PQ4) ; also sheet 3,5
RESET: SLOT3.93(RESET) SLOT4.93(RESET) SLOT5.93(RESET) ; also sheet 3,5
VREF: SLOT3.33(VREF) SLOT4.33(VREF) SLOT5.33(VREF) ; also sheet 3,5
WAKE: SLOT3.96(WAKE) SLOT4.96(WAKE) SLOT5.96(WAKE) ; also sheet 3,5

## Sheet 5 of 5
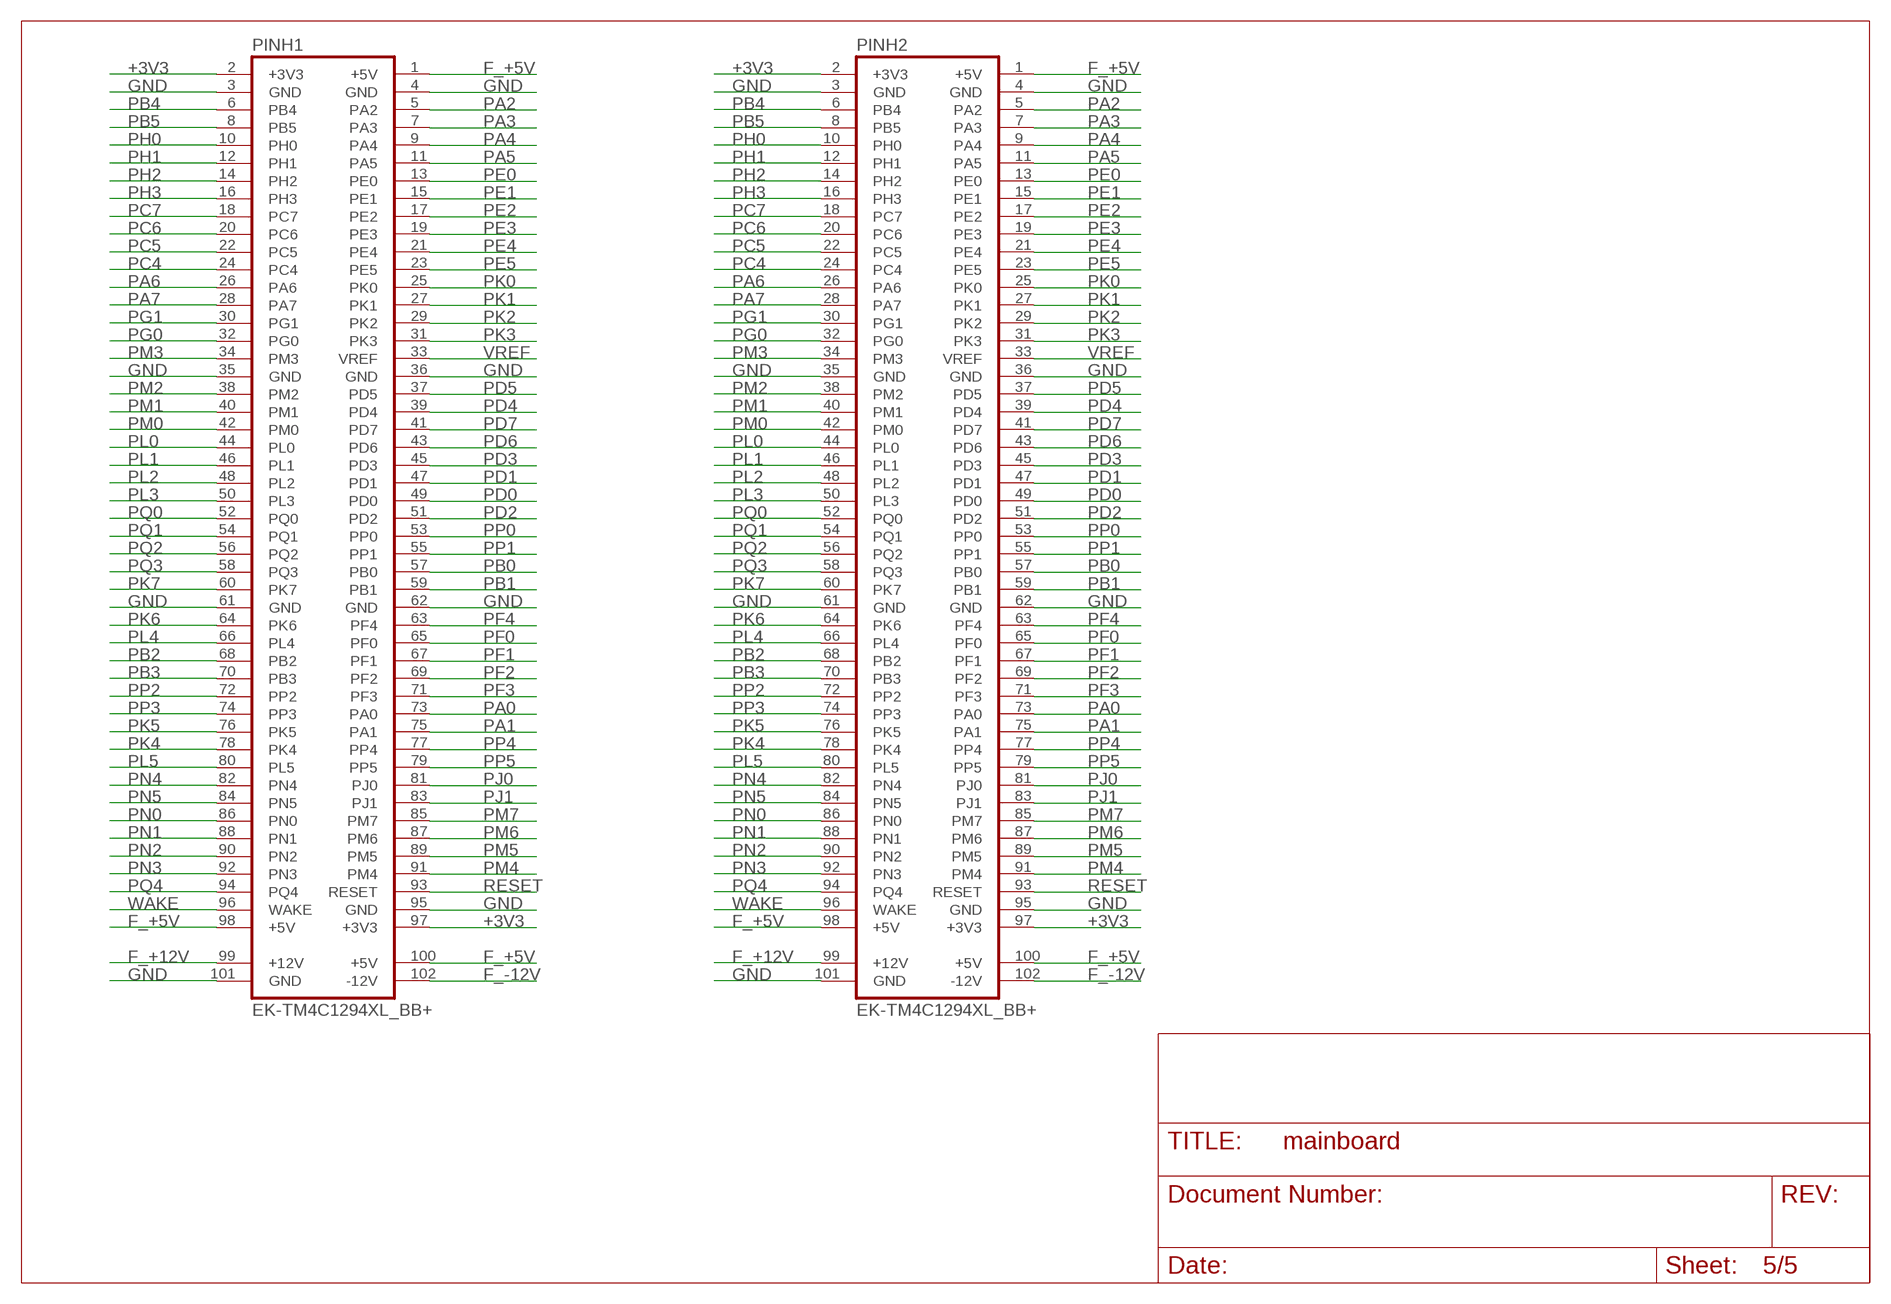
[diagram p4: schematic, sheet 5]

### Parts
PINH1  EK-TM4C1294XL_BB+  [EK-TM4C1294XL_BB+]
PINH2  EK-TM4C1294XL_BB+  [EK-TM4C1294XL_BB+]

### Nets
+3V3: PINH1.2(+3V3) PINH1.97(+3V3) PINH2.2(+3V3) PINH2.97(+3V3) ; also sheet 3,4
F_+5V: PINH1.1(+5V) PINH1.98(+5V) PINH1.100(+5V) PINH2.1(+5V) PINH2.98(+5V) PINH2.100(+5V) ; also sheet 1,2,3,4
F_+12V: PINH1.99(+12V) PINH2.99(+12V) ; also sheet 1,3,4
F_-12V: PINH1.102(-12V) PINH2.102(-12V) ; also sheet 1,3,4
GND: PINH1.3(GND) PINH1.4(GND) PINH1.35(GND) PINH1.36(GND) PINH1.61(GND) PINH1.62(GND) PINH1.95(GND) PINH1.101(GND) PINH2.3(GND) PINH2.4(GND) PINH2.35(GND) PINH2.36(GND) PINH2.61(GND) PINH2.62(GND) PINH2.95(GND) PINH2.101(GND) ; also sheet 1,2,3,4
PA0: PINH1.73(PA0) PINH2.73(PA0) ; also sheet 2,3,4
PA1: PINH1.75(PA1) PINH2.75(PA1) ; also sheet 2,3,4
PA2: PINH1.5(PA2) PINH2.5(PA2) ; also sheet 3,4
PA3: PINH1.7(PA3) PINH2.7(PA3) ; also sheet 3,4
PA4: PINH1.9(PA4) PINH2.9(PA4) ; also sheet 2,3,4
PA5: PINH1.11(PA5) PINH2.11(PA5) ; also sheet 2,3,4
PA6: PINH1.26(PA6) PINH2.26(PA6) ; also sheet 2,3,4
PA7: PINH1.28(PA7) PINH2.28(PA7) ; also sheet 2,3,4
PB0: PINH1.57(PB0) PINH2.57(PB0) ; also sheet 2,3,4
PB1: PINH1.59(PB1) PINH2.59(PB1) ; also sheet 2,3,4
PB2: PINH1.68(PB2) PINH2.68(PB2) ; also sheet 3,4
PB3: PINH1.70(PB3) PINH2.70(PB3) ; also sheet 3,4
PB4: PINH1.6(PB4) PINH2.6(PB4) ; also sheet 3,4
PB5: PINH1.8(PB5) PINH2.8(PB5) ; also sheet 3,4
PC4: PINH1.24(PC4) PINH2.24(PC4) ; also sheet 2,3,4
PC5: PINH1.22(PC5) PINH2.22(PC5) ; also sheet 2,3,4
PC6: PINH1.20(PC6) PINH2.20(PC6) ; also sheet 2,3,4
PC7: PINH1.18(PC7) PINH2.18(PC7) ; also sheet 2,3,4
PD0: PINH1.49(PD0) PINH2.49(PD0) ; also sheet 3,4
PD1: PINH1.47(PD1) PINH2.47(PD1) ; also sheet 3,4
PD2: PINH1.51(PD2) PINH2.51(PD2) ; also sheet 3,4
PD3: PINH1.45(PD3) PINH2.45(PD3) ; also sheet 3,4
PD4: PINH1.39(PD4) PINH2.39(PD4) ; also sheet 3,4
PD5: PINH1.37(PD5) PINH2.37(PD5) ; also sheet 3,4
PD6: PINH1.43(PD6) PINH2.43(PD6) ; also sheet 3,4
PD7: PINH1.41(PD7) PINH2.41(PD7) ; also sheet 3,4
PE0: PINH1.13(PE0) PINH2.13(PE0) ; also sheet 3,4
PE1: PINH1.15(PE1) PINH2.15(PE1) ; also sheet 3,4
PE2: PINH1.17(PE2) PINH2.17(PE2) ; also sheet 3,4
PE3: PINH1.19(PE3) PINH2.19(PE3) ; also sheet 3,4
PE4: PINH1.21(PE4) PINH2.21(PE4) ; also sheet 3,4
PE5: PINH1.23(PE5) PINH2.23(PE5) ; also sheet 3,4
PF0: PINH1.65(PF0) PINH2.65(PF0) ; also sheet 1,3,4
PF1: PINH1.67(PF1) PINH2.67(PF1) ; also sheet 3,4
PF2: PINH1.69(PF2) PINH2.69(PF2) ; also sheet 3,4
PF3: PINH1.71(PF3) PINH2.71(PF3) ; also sheet 3,4
PF4: PINH1.63(PF4) PINH2.63(PF4) ; also sheet 1,3,4
PG0: PINH1.32(PG0) PINH2.32(PG0) ; also sheet 3,4
PG1: PINH1.30(PG1) PINH2.30(PG1) ; also sheet 3,4
PH0: PINH1.10(PH0) PINH2.10(PH0) ; also sheet 3,4
PH1: PINH1.12(PH1) PINH2.12(PH1) ; also sheet 3,4
PH2: PINH1.14(PH2) PINH2.14(PH2) ; also sheet 3,4
PH3: PINH1.16(PH3) PINH2.16(PH3) ; also sheet 3,4
PJ0: PINH1.81(PJ0) PINH2.81(PJ0) ; also sheet 3,4
PJ1: PINH1.83(PJ1) PINH2.83(PJ1) ; also sheet 3,4
PK0: PINH1.25(PK0) PINH2.25(PK0) ; also sheet 2,3,4
PK1: PINH1.27(PK1) PINH2.27(PK1) ; also sheet 2,3,4
PK2: PINH1.29(PK2) PINH2.29(PK2) ; also sheet 3,4
PK3: PINH1.31(PK3) PINH2.31(PK3) ; also sheet 3,4
PK4: PINH1.78(PK4) PINH2.78(PK4) ; also sheet 3,4
PK5: PINH1.76(PK5) PINH2.76(PK5) ; also sheet 3,4
PK6: PINH1.64(PK6) PINH2.64(PK6) ; also sheet 3,4
PK7: PINH1.60(PK7) PINH2.60(PK7) ; also sheet 3,4
PL0: PINH1.44(PL0) PINH2.44(PL0) ; also sheet 3,4
PL1: PINH1.46(PL1) PINH2.46(PL1) ; also sheet 3,4
PL2: PINH1.48(PL2) PINH2.48(PL2) ; also sheet 3,4
PL3: PINH1.50(PL3) PINH2.50(PL3) ; also sheet 3,4
PL4: PINH1.66(PL4) PINH2.66(PL4) ; also sheet 3,4
PL5: PINH1.80(PL5) PINH2.80(PL5) ; also sheet 3,4
PM0: PINH1.42(PM0) PINH2.42(PM0) ; also sheet 3,4
PM1: PINH1.40(PM1) PINH2.40(PM1) ; also sheet 3,4
PM2: PINH1.38(PM2) PINH2.38(PM2) ; also sheet 3,4
PM3: PINH1.34(PM3) PINH2.34(PM3) ; also sheet 3,4
PM4: PINH1.91(PM4) PINH2.91(PM4) ; also sheet 3,4
PM5: PINH1.89(PM5) PINH2.89(PM5) ; also sheet 3,4
PM6: PINH1.87(PM6) PINH2.87(PM6) ; also sheet 3,4
PM7: PINH1.85(PM7) PINH2.85(PM7) ; also sheet 3,4
PN0: PINH1.86(PN0) PINH2.86(PN0) ; also sheet 1,3,4
PN1: PINH1.88(PN1) PINH2.88(PN1) ; also sheet 1,3,4
PN2: PINH1.90(PN2) PINH2.90(PN2) ; also sheet 3,4
PN3: PINH1.92(PN3) PINH2.92(PN3) ; also sheet 3,4
PN4: PINH1.82(PN4) PINH2.82(PN4) ; also sheet 3,4
PN5: PINH1.84(PN5) PINH2.84(PN5) ; also sheet 3,4
PP0: PINH1.53(PP0) PINH2.53(PP0) ; also sheet 2,3,4
PP1: PINH1.55(PP1) PINH2.55(PP1) ; also sheet 2,3,4
PP2: PINH1.72(PP2) PINH2.72(PP2) ; also sheet 3,4
PP3: PINH1.74(PP3) PINH2.74(PP3) ; also sheet 3,4
PP4: PINH1.77(PP4) PINH2.77(PP4) ; also sheet 3,4
PP5: PINH1.79(PP5) PINH2.79(PP5) ; also sheet 3,4
PQ0: PINH1.52(PQ0) PINH2.52(PQ0) ; also sheet 3,4
PQ1: PINH1.54(PQ1) PINH2.54(PQ1) ; also sheet 3,4
PQ2: PINH1.56(PQ2) PINH2.56(PQ2) ; also sheet 3,4
PQ3: PINH1.58(PQ3) PINH2.58(PQ3) ; also sheet 3,4
PQ4: PINH1.94(PQ4) PINH2.94(PQ4) ; also sheet 3,4
RESET: PINH1.93(RESET) PINH2.93(RESET) ; also sheet 3,4
VREF: PINH1.33(VREF) PINH2.33(VREF) ; also sheet 3,4
WAKE: PINH1.96(WAKE) PINH2.96(WAKE) ; also sheet 3,4

## Library data of the parts
#FAULT CANRX CANTX URX UTX = ownparts:PINH-1X1*: 1x1 pol. Stiftleisten, RM 2.54
C1 C2 = ownparts:C2220
C3-C8 C10 C11 C13-C15 = rcl:C-EU: CAPACITOR, European symbol
C9 = ownparts:C1812
D1-D3 = diode:1N5333: Z DIODE
EK-TM4C1294XL PINH1 PINH2 SLOT1-SLOT5 = ownparts:EK-TM4C1294XL_BB+
F1-F3 = fuse:FUSE: Fuse; OC_FARNELL: unknown; OC_NEWARK: unknown
IC1 IC6 = ownparts:CD74HC4051*
IC2 = ownparts:MCP2551*: High-Speed CAN Transceiver
IC3 = ownparts:MAX3250
IC5 = ownparts:CD74HC4053*
IC8 = ownparts:SN74HCT125*
JP1 = ownparts:W1X4
JP_CAN = ownparts:PINH-1X2*: 1x2 pol. Stiftleisten, RM 2.54
JP_SHIELD = ownparts:PINH-1X3*: 1x3 pol. Stiftleisten, RM 2.54
LED1 = ownparts:LED2X4
R1-R18 = rcl:R-EU_: RESISTOR, European symbol
SW_CAN = ownparts:NT01
SW_UART = ownparts:NT03
X1 = con-subd:M09HP: SUB-D; OC_FARNELL: unknown; OC_NEWARK: unknown
X2 = con-subd:F09HP: SUB-D; OC_FARNELL: unknown; OC_NEWARK: unknown